# Altium schematic sheet DP_UART.SchDoc
size A4; SheetNumber: 1; SheetTotal: 2
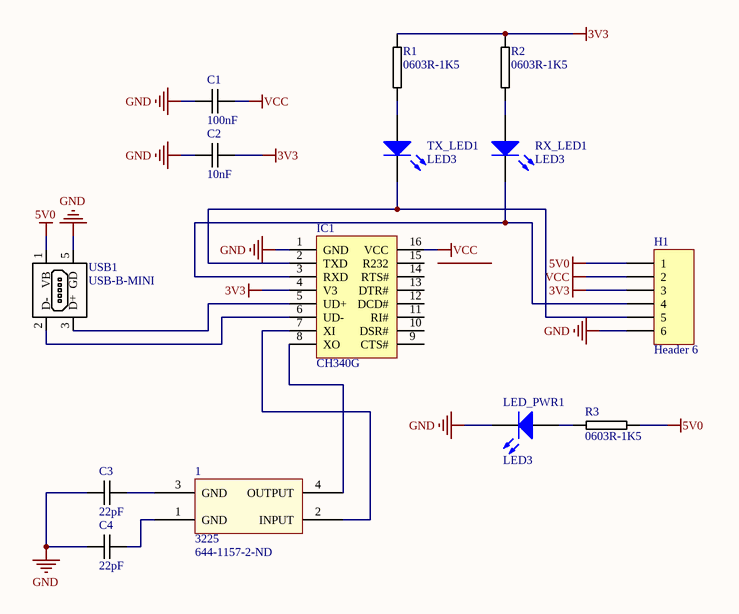
[diagram p0: DP_UART.SchDoc]

## Parts
1  3225  Supplier Part Number 1: 644-1157-2-ND  [XTAL 3225]
C1  100nF  [0603C-GENERIC]
C2  10nF  [0603C-GENERIC]
C3  22pF  [0603C-GENERIC]
C4  22pF  [0603C-GENERIC]
H1  Header 6  [HDR1X6]
IC1  CH340G  [SO16]
LED_PWR1  LED3  [3.5X2.8X1.9]
R1  0603R-1K5  [0603R-1k5]
R2  0603R-1K5  [0603R-1k5]
R3  0603R-1K5  [0603R-1k5]
RX_LED1  LED3  [3.5X2.8X1.9]
TX_LED1  LED3  [3.5X2.8X1.9]
USB1  USB-B-MINI  [USB-MINI-B]

## Nets
3V3: C2.2 H1.3 IC1.4(V3) R1.1 R2.1
5V0: H1.1 R3.1 USB1.1(VB)
GND: C1.1 C2.1 C3.1 C4.1 H1.6 IC1.1(GND) LED_PWR1.2(K) USB1.5(GD)
VCC: C1.2 H1.2 IC1.16(VCC)
Net1_1: 1.1(GND) C4.2
Net1_2: 1.2(INPUT) IC1.7(XI)
Net1_3: 1.3(GND) C3.2
Net1_4: 1.4(OUTPUT) IC1.8(XO)
NetH1_4: H1.4 IC1.3(RXD) RX_LED1.2(K)
NetH1_5: H1.5 IC1.2(TXD) TX_LED1.2(K)
NetIC1_5: IC1.5(UD+) USB1.3(D+)
NetIC1_6: IC1.6(UD-) USB1.2(D-)
NetLED_PWR1_1: LED_PWR1.1(A) R3.2
NetR1_2: R1.2 TX_LED1.1(A)
NetR2_2: R2.2 RX_LED1.1(A)

Not connected (* = marked no-connect by the designer): IC1 9(CTS#) 10(DSR#) 11(RI#) 12(DCD#) 13(DTR#) 14(RTS#) 15(R232)

## Library data of the parts
1 = 3225 Quartz: Supplier 1: Digi-Key
C1 = Passives_Capacitors_0603_100NF-25V-X7R-TDK: CAPACITOR 0603 CERAMIC; Manufacturer Part Number: C1608X7R1E104K; Manufacturer: TDK Corporation; Reel: C12; Supplier 1: Digi-Key; Supplier Part Number 1: 445-1316-2-ND
C2 = Passives_Capacitors_0603_10NF-50V-X7R-MUR: CAPACITOR 0603 CERAMIC; Manufacturer Part Number: GRM188R71H103KA01D; Manufacturer: Murata Electronics North America; Reel: C22; Supplier 1: Digi-Key; Supplier Part Number 1: 490-1512-2-ND
C3 C4 = Passives_Capacitors_0603_22PF-50V-C0G-PAN: CAPACITOR 0603 CERAMIC; Manufacturer Part Number: ECJ-1VC1H220J; Manufacturer: Panasonic - ECG; Reel: C10; Tolerance: ±5%; Temperature Coefficient: C0G, NP0; Voltage - Rated: 50V; Supplier 1: Digi-Key; Features: General Purpose; Lead Spacing: -; Supplier: Digi-Key; Capacitance: 22pF; Packaging: Tape & Reel (TR); Mounting Type: Surface Mount, MLCC; RoHS: RoHS Compliant; Operating Temperature: -55°C ~ 125°C; Thickness: 0.80mm; Package / Case: 0603 (1608 metric); Category: Capacitors; Supplier Part Number 1: PCC220ACVTR-ND; Supplier Part Number: PCC220ACVTR-ND
H1 = Header 6: Header, 6-Pin; LatestRevisionDate: 17-Jul-2002; LatestRevisionNote: Re-released for DXP Platform.; Publisher: Altium Limited
LED_PWR1 RX_LED1 TX_LED1 = LED3: Typical BLUE SiC LED; Published: 8-Jun-2000; LatestRevisionDate: 17-Dec-2003; LatestRevisionNote: PCB Footprint replaced.; DatasheetVersion: 16-Apr-2002; PackageVersion: 16-Apr-2002; PackageReference: 3.5X2.8X1.9; Publisher: Altium Limited; PackageDescription: SM LED; 2 C-Bend Leads; Body 3.5 x 2.8 x 1.9 mm, inc leads (LxWxH typ)
R1-R3 = 0603R-1K5: GENERIC RESISTOR 0603; Manufacturer Part Number: RMCF 1/16 15K 1% R; Manufacturer: Stackpole Electronics Inc; Tolerance: ±1%; Resistance In Ohms: 15.0K; Power (Watts): 0.1W, 1/10W; Temperature Coefficient: ±100ppm/°C; Supplier 1: Digi-Key; Supplier Part Number 1: RMCF1/1615KFRTR-ND; Supplier: Digi-Key; Supplier Part Number: RMCF1/1615KFRTR-ND; Packaging: Tape & Reel (TR); Category: Resistors; Case: 0603 (1608 metric); Composition: Thick Film; Lead Style: Surface Mount (SMD - SMT); RoHS: RoHS Compliant
USB1 = Connector_USB_THT_USB-B-MINI: MINI USB B DEVICE CONNECTOR